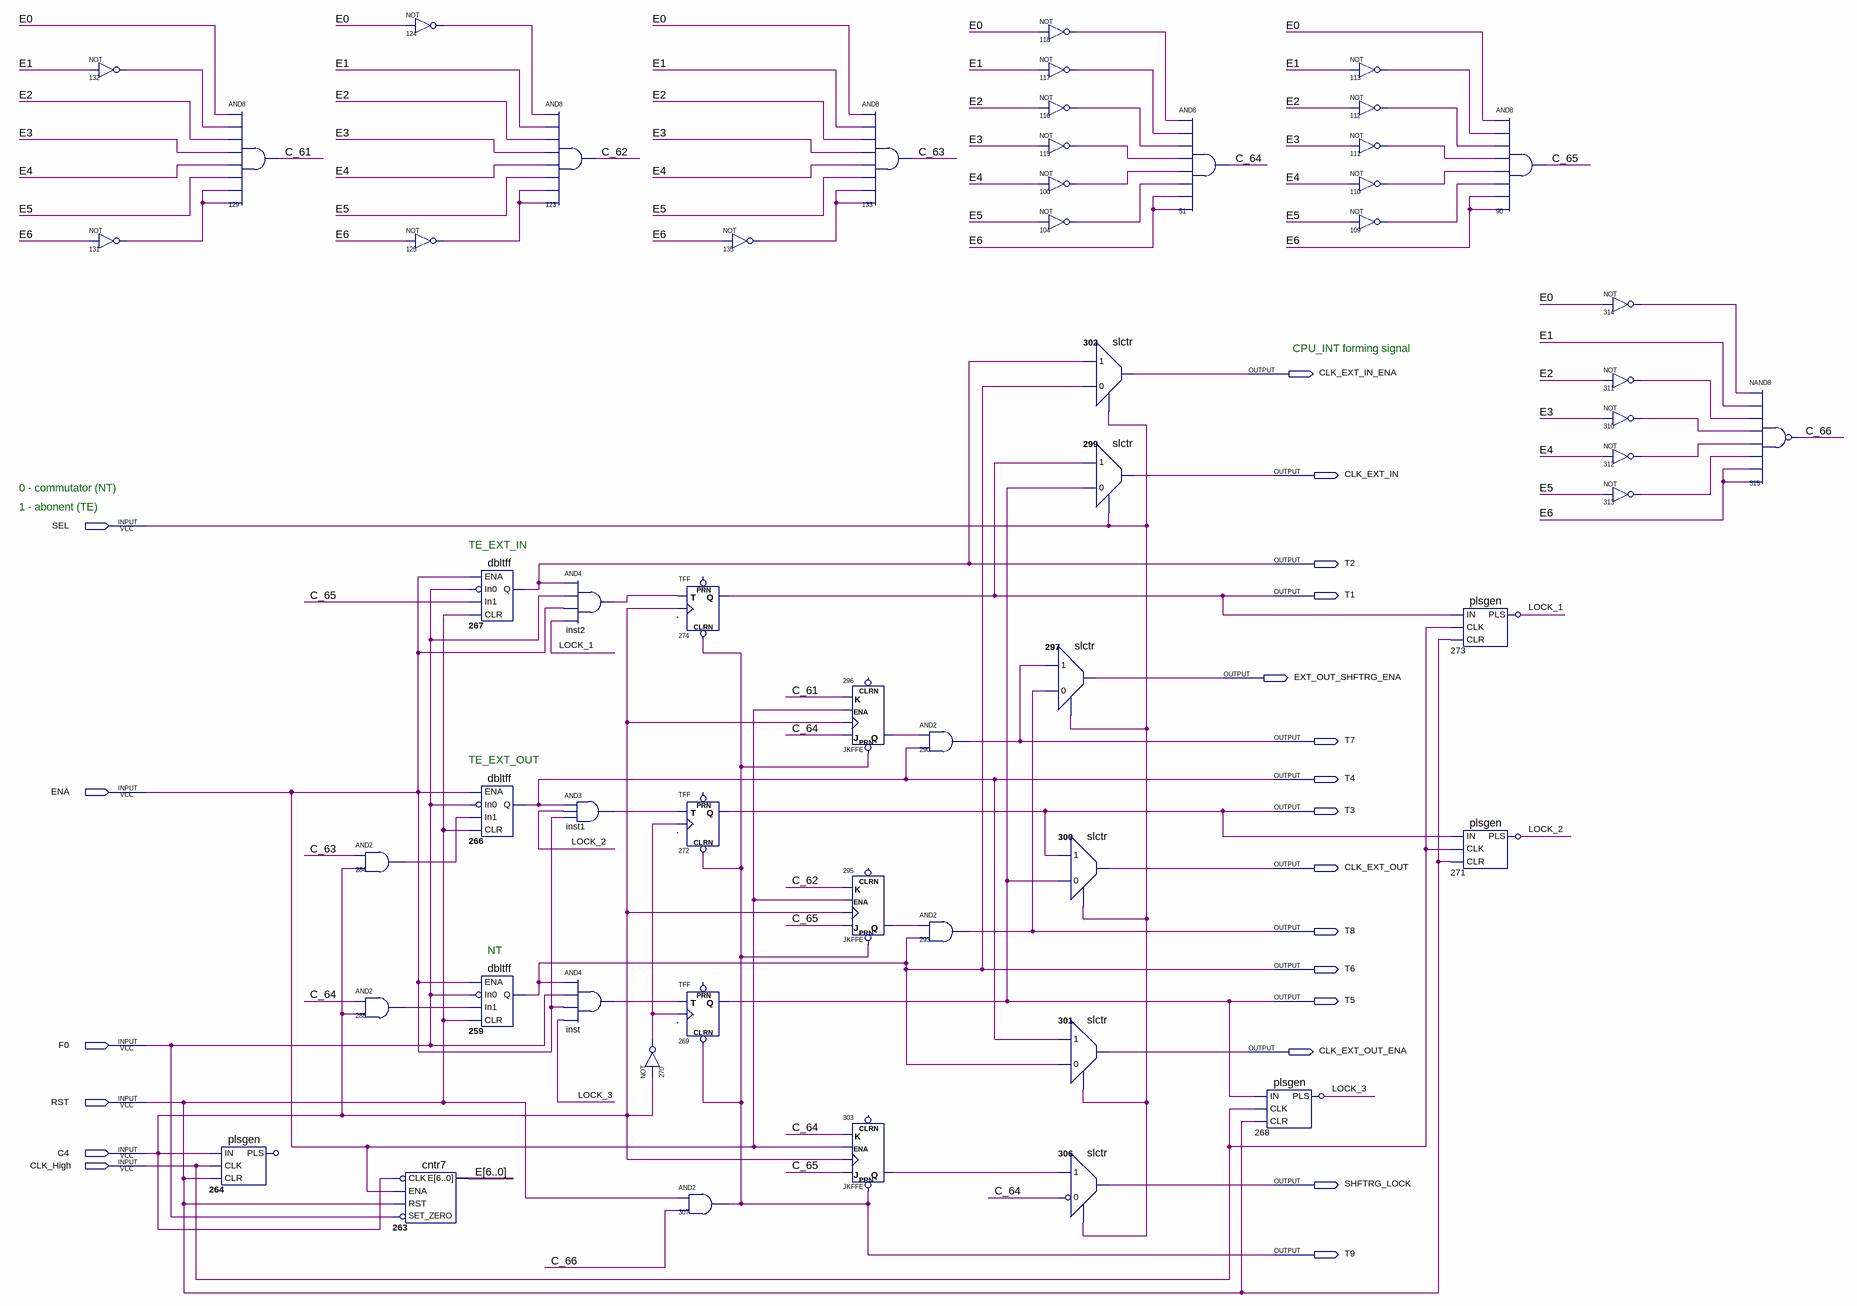
[diagram p0: schematic sheet]
// Quartus schematic shrg_ctrl3_old.bdf as structural Verilog: 56 symbols, 21 pins
module shrg_ctrl3_old (
  input  SEL,
  input  ENA,
  input  F0,
  input  RST,
  input  C4,
  input  CLK_High,
  output CLK_EXT_IN_ENA,
  output CLK_EXT_IN,
  output T2,
  output T1,
  output EXT_OUT_SHFTRG_ENA,
  output T7,
  output T4,
  output T3,
  output CLK_EXT_OUT,
  output T8,
  output T6,
  output T5,
  output CLK_EXT_OUT_ENA,
  output SHFTRG_LOCK,
  output T9
);

  wire C_61, C_62, C_63, C_64, C_65, C_66, inst1_out, inst2_out, inst_out, LOCK_1, LOCK_2, LOCK_3, n100_out,
       n104_out, n109_out, n110_out, n111_out, n112_out, n113_out, n115_out, n116_out, n117_out, n118_out,
       n124_out, n125_out, n131_out, n132_out, n135_out, n268_pls, n270_out, n271_pls, n273_pls, n284_out,
       n288_out, n295_q, n296_q, n303_q, n310_out, n311_out, n312_out, n313_out, n314_out;
  wire [6:0] E;

  not u_132 (n132_out, E[1]);
  not u_131 (n131_out, E[6]);
  and u_129 (C_61, E[0], n132_out, E[2], E[3], E[4], E[5], n131_out, n131_out);
  plsgen u_264 (.IN(C4), .CLK(CLK_High), .CLR(RST));  // open: PLS
  and u_284 (n284_out, C_63, C4);
  and u_288 (n288_out, C_64, C4);
  not u_124 (n124_out, E[0]);
  not u_125 (n125_out, E[6]);
  cntr7 u_263 (.CLK(~C4), .ENA(ENA), .RST(RST), .SET_ZERO(~F0), .E(E));
  dbltff u_267 (.ENA(ENA), .In0(~F0), .In1(C_65), .CLR(RST), .Q(T2));
  dbltff u_266 (.ENA(ENA), .In0(~F0), .In1(n284_out), .CLR(RST), .Q(T4));
  dbltff u_259 (.ENA(ENA), .In0(~F0), .In1(n288_out), .CLR(RST), .Q(T6));
  and u_123 (C_62, n124_out, E[1], E[2], E[3], E[4], E[5], n125_out, n125_out);
  and inst2 (inst2_out, T2, F0, ENA, LOCK_1);
  and inst1 (inst1_out, T4, LOCK_2, ENA);
  and inst (inst_out, T6, F0, ENA, LOCK_3);
  not u_270 (n270_out, C4);
  TFF u_274 (.CLRN(T9), .T(inst2_out), .CLK(C4), .Q(T1));  // open: PRN
  TFF u_272 (.CLRN(T9), .T(inst1_out), .CLK(n270_out), .Q(T3));  // open: PRN
  TFF u_269 (.CLRN(T9), .T(inst_out), .CLK(n270_out), .Q(T5));  // open: PRN
  and u_307 (T9, RST, C_66);
  not u_135 (n135_out, E[6]);
  and u_133 (C_63, E[0], E[1], E[2], E[3], E[4], E[5], n135_out, n135_out);
  JKFFE u_296 (.PRN(T9), .J(C_64), .CLK(C4), .K(C_61), .ENA(ENA), .Q(n296_q));  // open: CLRN
  JKFFE u_295 (.PRN(T9), .J(C_65), .CLK(C4), .K(C_62), .ENA(ENA), .Q(n295_q));  // open: CLRN
  JKFFE u_303 (.PRN(T9), .J(C_65), .CLK(C4), .K(C_64), .ENA(ENA), .Q(n303_q));  // open: CLRN
  and u_290 (T7, n296_q, T4);
  and u_293 (T8, n295_q, T6);
  not u_118 (n118_out, E[0]);
  not u_117 (n117_out, E[1]);
  not u_116 (n116_out, E[2]);
  not u_115 (n115_out, E[3]);
  not u_100 (n100_out, E[4]);
  not u_104 (n104_out, E[5]);
  slctr u_297 (.SEL(SEL), .In0(T8), .In1(T7), .Out(EXT_OUT_SHFTRG_ENA));
  slctr u_300 (.SEL(SEL), .In0(T5), .In1(T3), .Out(CLK_EXT_OUT));
  slctr u_301 (.SEL(SEL), .In0(T6), .In1(T4), .Out(CLK_EXT_OUT_ENA));
  slctr u_306 (.SEL(SEL), .In0(~C_64), .In1(n303_q), .Out(SHFTRG_LOCK));
  slctr u_302 (.SEL(SEL), .In0(T6), .In1(T2), .Out(CLK_EXT_IN_ENA));
  slctr u_299 (.SEL(SEL), .In0(T5), .In1(T1), .Out(CLK_EXT_IN));
  and u_51 (C_64, n118_out, n117_out, n116_out, n115_out, n100_out, n104_out, E[6], E[6]);
  plsgen u_268 (.IN(T5), .CLK(CLK_High), .CLR(RST), .PLS(n268_pls));
  not u_268_PLS_inverted (LOCK_3, n268_pls);
  not u_113 (n113_out, E[1]);
  not u_112 (n112_out, E[2]);
  not u_111 (n111_out, E[3]);
  not u_110 (n110_out, E[4]);
  not u_109 (n109_out, E[5]);
  plsgen u_273 (.IN(T1), .CLK(CLK_High), .CLR(RST), .PLS(n273_pls));
  not u_273_PLS_inverted (LOCK_1, n273_pls);
  plsgen u_271 (.IN(T3), .CLK(CLK_High), .CLR(RST), .PLS(n271_pls));
  not u_271_PLS_inverted (LOCK_2, n271_pls);
  and u_90 (C_65, E[0], n113_out, n112_out, n111_out, n110_out, n109_out, E[6], E[6]);
  not u_314 (n314_out, E[0]);
  not u_311 (n311_out, E[2]);
  not u_310 (n310_out, E[3]);
  not u_312 (n312_out, E[4]);
  not u_313 (n313_out, E[5]);
  nand u_315 (C_66, n314_out, E[1], n311_out, n310_out, n312_out, n313_out, E[6], E[6]);

  // Notes on the sheet:
  //   CPU_INT forming signal
  //   0 - commutator (NT)
  //   1 - abonent (TE)
  //   TE_EXT_IN
  //   TE_EXT_OUT
  //   NT
endmodule
